# EAGLE schematic Layout (EAGLE 8.4.3)
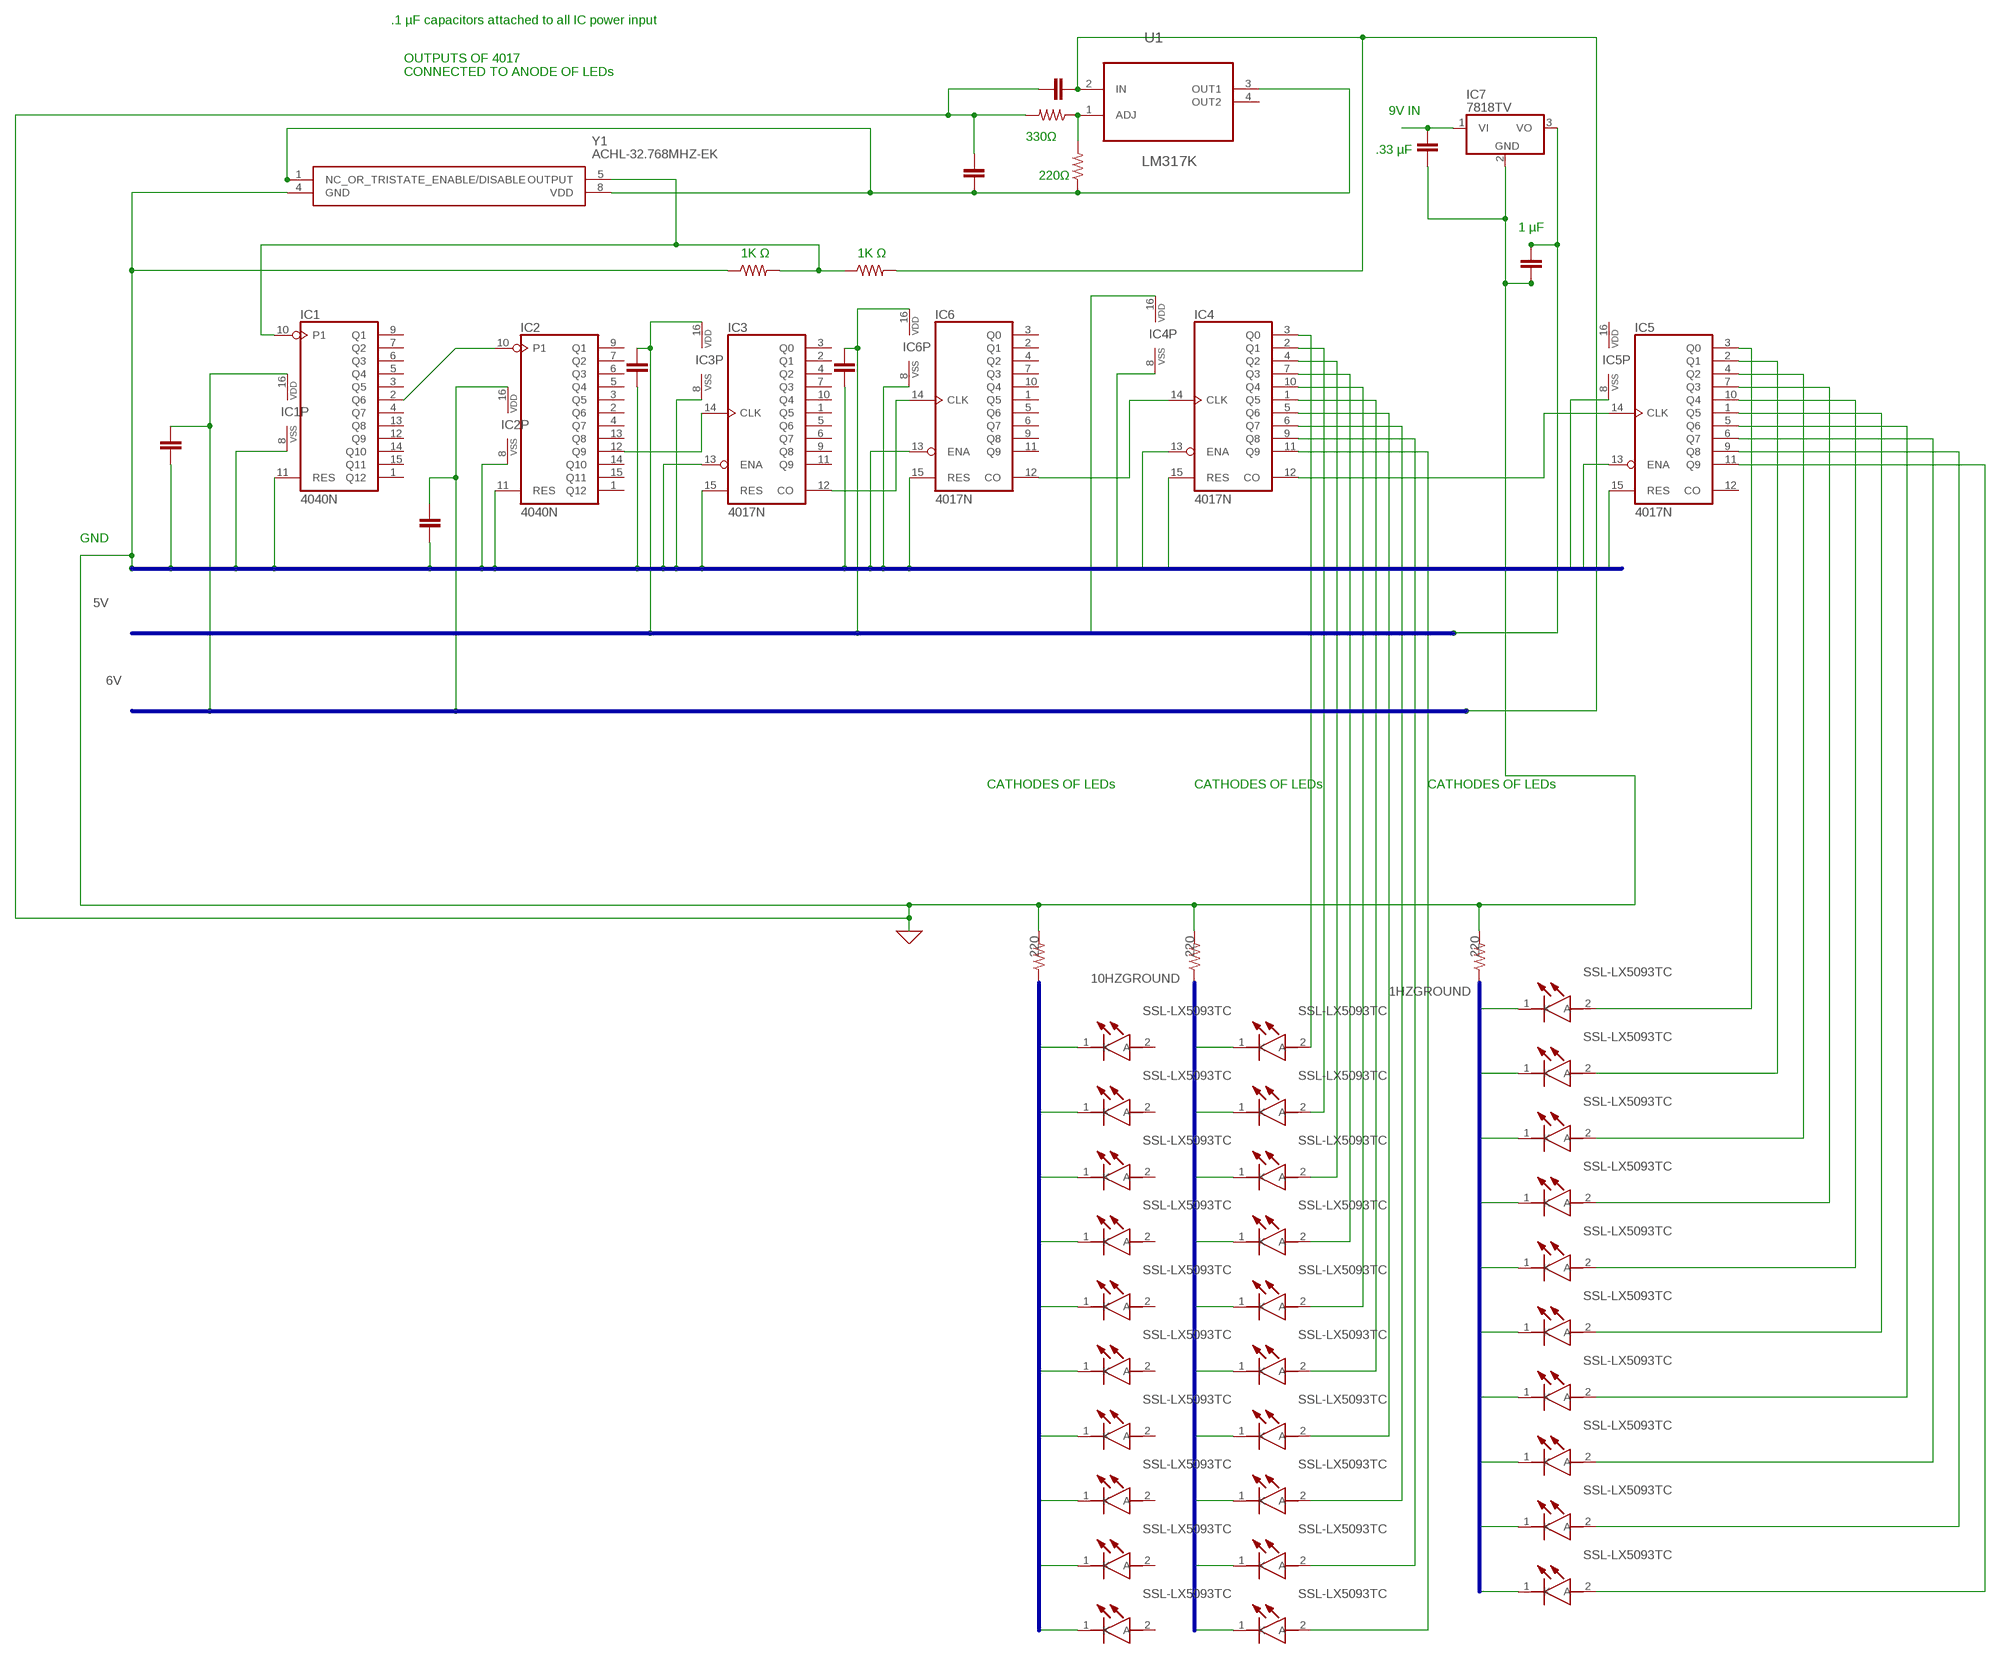
[diagram p0: schematic, sheet 1]

## Parts
IC1  4040N  [DIL16]
IC2  4040N  [DIL16]
IC3  4017N  [DIL16]
IC4  4017N  [DIL16]
IC5  4017N  [DIL16]
IC6  4017N  [DIL16]
IC7  7818TV  [TO220V]
LED1  SSL-LX5093TC  [SSL-LX5093SGC/B]
LED2  SSL-LX5093TC  [SSL-LX5093SGC/B]
LED3  SSL-LX5093TC  [SSL-LX5093SGC/B]
LED4  SSL-LX5093TC  [SSL-LX5093SGC/B]
LED5  SSL-LX5093TC  [SSL-LX5093SGC/B]
LED6  SSL-LX5093TC  [SSL-LX5093SGC/B]
LED7  SSL-LX5093TC  [SSL-LX5093SGC/B]
LED8  SSL-LX5093TC  [SSL-LX5093SGC/B]
LED9  SSL-LX5093TC  [SSL-LX5093SGC/B]
LED10  SSL-LX5093TC  [SSL-LX5093SGC/B]
LED11  SSL-LX5093TC  [SSL-LX5093SGC/B]
LED12  SSL-LX5093TC  [SSL-LX5093SGC/B]
LED13  SSL-LX5093TC  [SSL-LX5093SGC/B]
LED14  SSL-LX5093TC  [SSL-LX5093SGC/B]
LED15  SSL-LX5093TC  [SSL-LX5093SGC/B]
LED16  SSL-LX5093TC  [SSL-LX5093SGC/B]
LED17  SSL-LX5093TC  [SSL-LX5093SGC/B]
LED18  SSL-LX5093TC  [SSL-LX5093SGC/B]
LED19  SSL-LX5093TC  [SSL-LX5093SGC/B]
LED20  SSL-LX5093TC  [SSL-LX5093SGC/B]
LED21  SSL-LX5093TC  [SSL-LX5093SGC/B]
LED22  SSL-LX5093TC  [SSL-LX5093SGC/B]
LED23  SSL-LX5093TC  [SSL-LX5093SGC/B]
LED24  SSL-LX5093TC  [SSL-LX5093SGC/B]
LED25  SSL-LX5093TC  [SSL-LX5093SGC/B]
LED26  SSL-LX5093TC  [SSL-LX5093SGC/B]
LED27  SSL-LX5093TC  [SSL-LX5093SGC/B]
LED28  SSL-LX5093TC  [SSL-LX5093SGC/B]
LED29  SSL-LX5093TC  [SSL-LX5093SGC/B]
LED30  SSL-LX5093TC  [SSL-LX5093SGC/B]
R1  220  R-US_0207/12  [0207/12]
R2  220  R-US_0207/12  [0207/12]
R3  220  R-US_0207/12  [0207/12]
R4  220  R-US_0309/12  [0309/12]
R5  R-US_0309/12  [0309/12]
R6  R-US_0309/12  [0309/12]
R7  R-US_0309/12  [0309/12]
U1  LM317K  [TO1090P3010X870-4P]
Y1  ACHL-32.768MHZ-EK  [ACHL]

## Nets
1HZGROUND: LED1.1(K) LED2.1(K) LED3.1(K) LED4.1(K) LED5.1(K) LED6.1(K) LED7.1(K) LED8.1(K) LED9.1(K) LED10.1(K)
5V: IC3.16(VDD) IC4.16(VDD) IC6.16(VDD) IC7.3(VO)
6V: IC1.16(VDD) IC2.16(VDD) U1.2(IN)
10HZGROUND: LED11.1(K) LED12.1(K) LED13.1(K) LED14.1(K) LED15.1(K) LED16.1(K) LED17.1(K) LED18.1(K) LED19.1(K) LED20.1(K) LED21.1(K) LED22.1(K) LED23.1(K) LED24.1(K) LED25.1(K) LED26.1(K) LED27.1(K) LED28.1(K) LED29.1(K) LED30.1(K)
N$1: IC1.2(Q6) IC1.8(VSS) IC1.11(RES) IC2.8(VSS) IC2.10(P1) IC2.11(RES) IC3.8(VSS) IC3.13(ENA) IC3.15(RES) IC4.8(VSS) IC4.13(ENA) IC4.15(RES) IC5.8(VSS) IC5.13(ENA) IC5.15(RES) IC6.8(VSS) IC6.13(ENA) IC6.15(RES) IC7.2(GND) R3.2 Y1.4(GND) ; supply symbol labelled GND
N$2: IC2.12(Q9) IC3.14(CLK)
N$3: IC3.12(CO) IC6.14(CLK)
N$4: IC4.14(CLK) IC6.12(CO)
N$5: IC4.12(CO) IC5.14(CLK)
N$6: IC1.10(P1) Y1.5(OUTPUT)
N$7: U1.3(OUT1) Y1.1(NC_OR_TRISTATE_ENABLE/DISABLE) Y1.8(VDD)
N$8: IC7.1(VI)
N$9: U1.1(ADJ)
N$10: IC5.3(Q0) LED1.2(A)
N$11: IC5.2(Q1) LED2.2(A)
N$12: IC5.4(Q2) LED3.2(A)
N$13: IC5.7(Q3) LED4.2(A)
N$14: IC5.10(Q4) LED5.2(A)
N$15: IC5.1(Q5) LED6.2(A)
N$16: IC5.5(Q6) LED7.2(A)
N$17: IC5.6(Q7) LED8.2(A)
N$18: IC5.9(Q8) LED9.2(A)
N$19: IC5.11(Q9) LED10.2(A)
N$20: IC4.3(Q0) LED11.2(A)
N$21: IC4.2(Q1) LED12.2(A)
N$22: IC4.4(Q2) LED13.2(A)
N$23: IC4.7(Q3) LED14.2(A)
N$24: IC4.10(Q4) LED15.2(A)
N$25: IC4.1(Q5) LED16.2(A)
N$26: IC4.5(Q6) LED17.2(A)
N$27: IC4.6(Q7) LED18.2(A)
N$28: IC4.9(Q8) LED19.2(A)
N$29: IC4.11(Q9) LED20.2(A)
Unconnected: IC1.1(Q12) IC1.3(Q5) IC1.4(Q7) IC1.5(Q4) IC1.6(Q3) IC1.7(Q2) IC1.9(Q1) IC1.12(Q9) IC1.13(Q8) IC1.14(Q10) IC1.15(Q11) IC2.1(Q12) IC2.2(Q6) IC2.3(Q5) IC2.4(Q7) IC2.5(Q4) IC2.6(Q3) IC2.7(Q2) IC2.9(Q1) IC2.13(Q8) IC2.14(Q10) IC2.15(Q11) IC3.1(Q5) IC3.2(Q1) IC3.3(Q0) IC3.4(Q2) IC3.5(Q6) IC3.6(Q7) IC3.7(Q3) IC3.9(Q8) IC3.10(Q4) IC3.11(Q9) IC5.12(CO) IC6.1(Q5) IC6.2(Q1) IC6.3(Q0) IC6.4(Q2) IC6.5(Q6) IC6.6(Q7) IC6.7(Q3) IC6.9(Q8) IC6.10(Q4) IC6.11(Q9) LED21.2(A) LED22.2(A) LED23.2(A) LED24.2(A) LED25.2(A) LED26.2(A) LED27.2(A) LED28.2(A) LED29.2(A) LED30.2(A) R1.1 R1.2 R2.1 R2.2 R3.1 R4.1 R4.2 R5.1 R5.2 R6.1 R6.2 R7.1 R7.2 U1.4(OUT2)

## Buses
N$1
5V
6V
1HZGROUND
10HZGROUND

## Notes on the sheet
- .1 µF capacitors attached to all IC power input
- OUTPUTS OF 4017
  CONNECTED TO ANODE OF LEDs
- 9V IN
- 330Ω
- .33 µF
- 220Ω
- 1 µF
- 1K Ω | 1K Ω
- GND
- CATHODES OF LEDs | CATHODES OF LEDs | CATHODES OF LEDs

## Power pins joined to a net without a drawn wire
VDD: IC5.16(VDD)

## Library data of the parts
IC1 IC2 = 40xx:4040: 12-stage binary/ripple COUNTER
IC3-IC6 = 40xx:4017: COUNTER/DIVIDER
IC7 = linear:78*: Positive VOLTAGE REGULATOR Source: http://cache.national.com/ds/LM/LM78L05.pdf http://www.fairchildsemi.com/ds/LM/LM7805.pdf
LED1-LED30 = SSL-LX5093TC:SSL-LX5093TC: Lumex SSL-LX5093TC Turquoise LED, 5mm (T-1 3/4) Clear, Dome Lens Through Hole Package Source: Datasheet <https://componentsearchengine.com/Datasheets/1/SSL-LX5093TC.pdf>; DESCRIPTION: Lumex SSL-LX5093TC Turquoise LED, 5mm (T-1 3/4) Clear, Dome Lens Through Hole Package; HEIGHT: mm; MANUFACTURER_NAME: Lumex; MANUFACTURER_PART_NUMBER: SSL-LX5093TC; MOUSER_PART_NUMBER: 696-SSL-LX5093TC; MOUSER_PRICE-STOCK: https://www.mouser.com/Search/Refine.aspx?Keyword=696-SSL-LX5093TC
R1 = rcl:R-US_: RESISTOR, American symbol; R6: 220
R2 = rcl:R-US_: RESISTOR, American symbol; R5: 220
R3 = rcl:R-US_: RESISTOR, American symbol; R4: 220
R4-R7 = rcl:R-US_: RESISTOR, American symbol
U1 = LM317K:LM317K: Voltage regulators; AVAILABILITY: Unavailable; DESCRIPTION: regulator, Power Management, Linear Regulators, pin, Semiconductors and Actives; MF: STMicroelectronics; MP: LM317K; PACKAGE: TO-3 Texas Instruments; PRICE: None
Y1 = ACHL-32.768MHZ-EK:ACHL-32.768MHZ-EK: Standard Clock Oscillators 32.768MHz 3.3V Source: Datasheet <https://abracon.com/Support/PackageDrawing/Oscillators/ACHL.PDF>; DESCRIPTION: Standard Clock Oscillators 32.768MHz 3.3V; HEIGHT: mm; MANUFACTURER_NAME: ABRACON; MANUFACTURER_PART_NUMBER: ACHL-32.768MHZ-EK; MOUSER_PART_NUMBER: 815-ACHL-32.768-EK; MOUSER_PRICE-STOCK: https://www.mouser.com/Search/Refine.aspx?Keyword=815-ACHL-32.768-EK